# EAGLE design rfm12b (EAGLE 6.5.0)
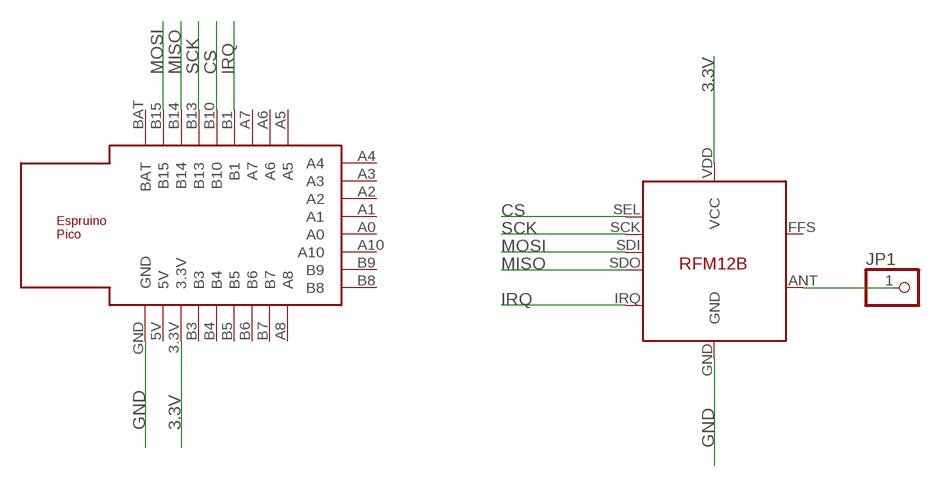
[diagram p0: schematic, sheet 1]

## Parts
JP1  PINHD-1X1  [1X01]
U$1  ESPRUINO_PICO_SMDONLY  [ESPRUINO_PICO_SMDONLY]
U$2  RFM12B  [RFM12B]

## Nets
3.3V: U$1.3.3V U$2.VDD(VCC)
CS: U$1.B10 U$2.SEL
GND: U$1.GND U$2.GND
IRQ: U$1.B1 U$2.IRQ
MISO: U$1.B14 U$2.SDO
MOSI: U$1.B15 U$2.SDI
N$1: JP1.1 U$2.ANT
SCK: U$1.B13 U$2.SCK
Unconnected: U$1.5V U$1.A0 U$1.A1 U$1.A2 U$1.A3 U$1.A4 U$1.A5 U$1.A6 U$1.A7 U$1.A8 U$1.A10 U$1.B3 U$1.B4 U$1.B5 U$1.B6 U$1.B7 U$1.B8 U$1.B9 U$1.BAT U$2.FFS

## Library data of the parts
JP1 = pinhead:PINHD-1X1: PIN HEADER
U$1 = espruino_pico:ESPRUINO_PICO_SMDONLY
U$2 = JeeParts:RFM12B

## Net classes
0 default: width 0.305 mm

## Board
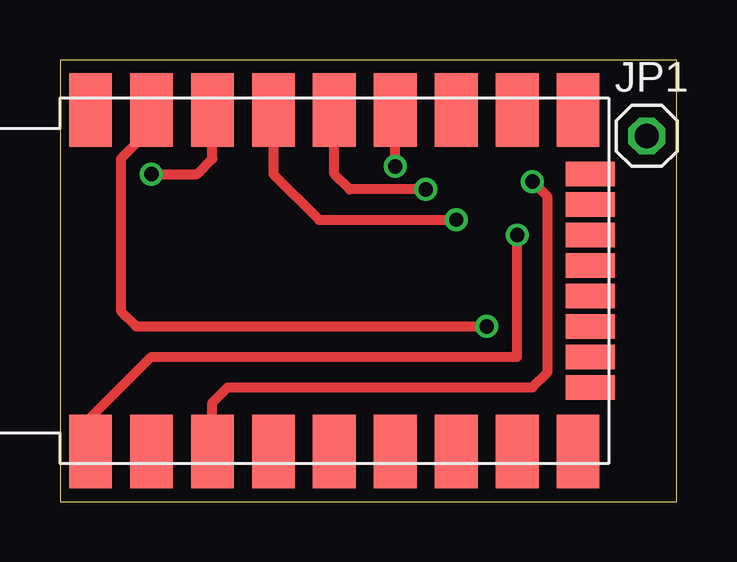
[diagram p1: board, top side]
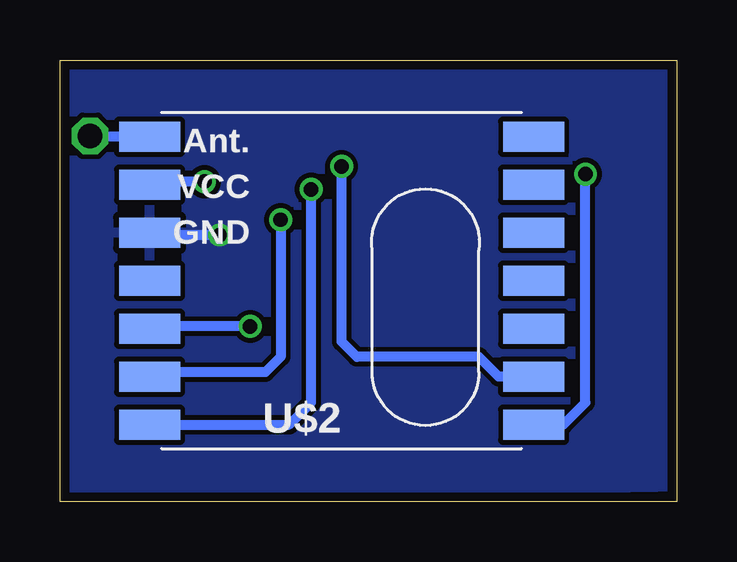
[diagram p2: board, bottom side, seen from below]

Size 25.7 x 18.41 mm. Coordinates in mm from the lower left corner, seen from the top.
Outline: 0,0 25.7,0 25.7,18.41 0,18.41 0,0
Copper layers (1*16): Top 0.0356mm / dielectric 1.5011mm / Bottom 0.0356mm
Design rules "oshpark": minimum track width 10mil, minimum drill 13mil, track to track 8mil, track to pad 6mil, pad to pad 6mil, via to via 6mil, smd to smd 6mil, copper to edge 15mil, drill to drill 6mil, minimum pad ring 7mil, minimum via ring 7mil, stop-mask expansion 4mil, vias tented up to drill 15mil, thermal gap 10mil

### Footprints (pad centres in the part's own frame; a part is rotated, then mirrored left to right if it is on the bottom)
1X01 = drill 1.016 octagon: 1 0,0
ESPRUINO_PICO_SMDONLY = smd 1.778 x 3.048: 3.3V -8.89,-7.112; 5V -11.43,-7.112; A5 6.35,7.112; A6 3.81,7.112; A7 1.27,7.112; A8 6.35,-7.112; B1 -1.27,7.112; B3 -6.35,-7.112; B4 -3.81,-7.112; B5 -1.27,-7.112; B6 1.27,-7.112; B7 3.81,-7.112; B10 -3.81,7.112; B13 -6.35,7.112; B14 -8.89,7.112; B15 -11.43,7.112; BAT -13.97,7.112; GND -13.97,-7.112 | smd 2.032 x 1.016: A0 6.858,-0.635; A1 6.858,0.635; A2 6.858,1.905; A3 6.858,3.175; A4 6.858,4.445; A10 6.858,-1.905; B8 6.858,-4.445; B9 6.858,-3.175
RFM12B = smd 2.54 x 1.27: ANT 8,-6; FFS -8,2; GND 8,-2; IRQ -8,4; P$8 -8,0; P$9 -8,-2; P$10 -8,-4; P$12 -8,-6; P$16 8,0; SCK 8,4; SDI 8,2; SDO -8,6; SEL 8,6; VDD 8,-4

### Placement (x,y rotation side)
JP1  24.45,15.24 0 top
U$1  15.24,9.21 0 top
U$2  13.97,9.21 180 bottom

### Tracks (layer width: path | path; a pad name or v marks a point on that pad's centre or on a via)
3.3V  (via drill 0.6)
  Top 0.406: U$1.3.3V 6.35,4.13 6.99,4.76 19.68,4.76 20.32,5.4 20.32,12.7 v19.68,13.34
  Bottom 0.406: 22.16,13.02 U$2.VDD 21.84,13.34 v19.68,13.34
CS  (via drill 0.6)
  Top 0.406: v15.24,13.02 12.06,13.02 11.43,13.65 U$1.B10
  Bottom 0.406: U$2.SEL 16.16,3.21 15.24,4.13 v15.24,13.02
GND  (via drill 0.6)
  Top 0.406: U$1.GND 1.27,3.49 3.81,6.03 19.05,6.03 v19.05,11.11
  Bottom 0.406: 22.07,11.11 U$2.GND 21.88,11.11 v19.05,11.11
  pour Bottom: -0.32,18.1 26.35,18.1 26.35,0.32 17.78,0.32 -0.32,0.64
IRQ  (via drill 0.6)
  Top 0.406: v13.97,13.97 U$1.B1
  Bottom 0.406: U$2.IRQ 7.43,5.21 8.26,6.03 13.34,6.03 13.97,6.67 v13.97,13.97
MISO  (via drill 0.6)
  Top 0.406: v3.81,13.65 5.71,13.65 6.35,14.29 U$1.B14
  Bottom 0.406: U$2.SDO 4.73,3.21 3.81,4.13 v3.81,13.65
MOSI  (via drill 0.6)
  Top 0.406: U$1.B15 3.81,15.56 2.54,14.29 2.54,7.94 3.17,7.3 v17.78,7.3
  Bottom 0.406: 22.07,7.3 U$2.SDI 21.88,7.3 v17.78,7.3
N$1
  Bottom 0.406: U$2.ANT 23.81,15.21 JP1.1
SCK  (via drill 0.6)
  Top 0.406: U$1.B13 8.89,13.65 10.79,11.75 v16.51,11.75
  Bottom 0.406: v16.51,11.75 16.51,6.03 17.14,5.4 21.78,5.4 U$2.SCK